# Altium schematic sheet Flatcaster-Link-sch.SchDoc
size A4; SheetNumber: 2; SheetTotal: 2
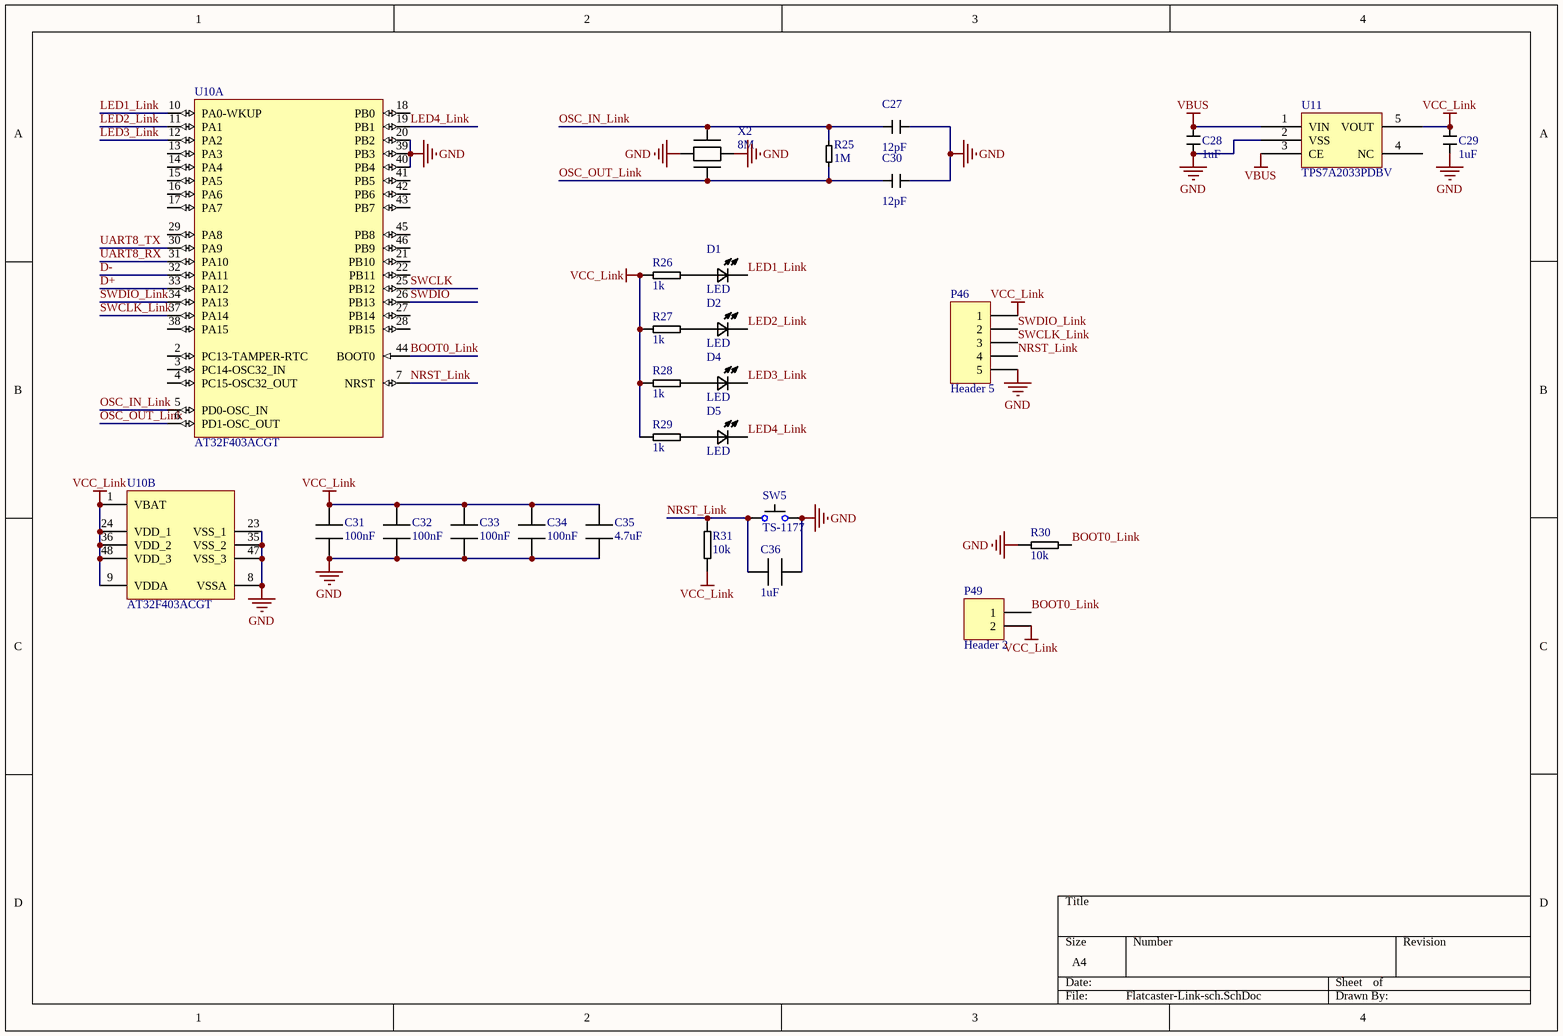
[diagram p0: Flatcaster-Link-sch.SchDoc]

## Parts
C27  12pF  [0603-Cap]
C28  1uF  [0603-Cap]
C29  1uF  [0603-Cap]
C30  12pF  [0603-Cap]
C31  100nF  [0603-Cap]
C32  100nF  [0603-Cap]
C33  100nF  [0603-Cap]
C34  100nF  [0603-Cap]
C35  4.7uF  [0603-Cap]
C36  1uF  [0603-Cap]
D1  LED  [0603-1]
D2  LED  [0603-1]
D4  LED  [0603-1]
D5  LED  [0603-1]
P46  Header 5  [HDR1X5]
P49  Header 2  [HDR1X2]
R25  1M  [0603]
R26  1k  [0603]
R27  1k  [0603]
R28  1k  [0603]
R29  1k  [0603]
R30  10k  [0603]
R31  10k  [0603]
SW5  TS-1177  [BTN3*3]
U10  AT32F403ACGT  [STM-LQFP48_N]  (parts A,B of 2)
U11  TPS7A2033PDBV  [SOT23-5]
X2  8M  [XTAL-3225-4P]

## Nets
GND: C27.1 C28.1 C29.1 C30.1 C31.2 C32.2 C33.2 C34.2 C35.2 C36.1 P46.5 R30.2 SW5.2 U10.8(VSSA) U10.20(PB2) U10.23(VSS_1) U10.35(VSS_2) U10.39(PB3) U10.40(PB4) U10.47(VSS_3) U11.2(VSS) X2.2 X2.4
VBUS: C28.2 U11.1(VIN) U11.3(CE)
VCC_Link: C29.2 C31.1 C32.1 C33.1 C34.1 C35.1 P46.1 P49.2 R26.2 R27.2 R28.2 R29.2 R31.1 U10.1(VBAT) U10.9(VDDA) U10.24(VDD_1) U10.36(VDD_2) U10.48(VDD_3) U11.5(VOUT)
BOOT0_Link: P49.1 R30.1 U10.44(BOOT0)
D+: U10.33(PA12)
D-: U10.32(PA11)
LED1_Link: D1.2 U10.10(PA0-WKUP)
LED2_Link: D2.2 U10.11(PA1)
LED3_Link: D4.2 U10.12(PA2)
LED4_Link: D5.2 U10.19(PB1)
NRST_Link: C36.2 P46.4 R31.2 SW5.1 U10.7(NRST)
OSC_IN_Link: C27.2 R25.2 U10.5(PD0-OSC_IN) X2.3
OSC_OUT_Link: C30.2 R25.1 U10.6(PD1-OSC_OUT) X2.1
SWCLK: U10.25(PB12)
SWCLK_Link: P46.3 U10.37(PA14)
SWDIO: U10.26(PB13)
SWDIO_Link: P46.2 U10.34(PA13)
UART8_RX: U10.31(PA10)
UART8_TX: U10.30(PA9)
NetD1_1: D1.1 R26.1
NetD2_1: D2.1 R27.1
NetD4_1: D4.1 R28.1
NetD5_1: D5.1 R29.1

Not connected (* = marked no-connect by the designer): U10 2(PC13-TAMPER-RTC) 3(PC14-OSC32_IN) 4(PC15-OSC32_OUT) 13(PA3) 14(PA4) 15(PA5) 16(PA6) 17(PA7) 18(PB0) 21(PB10) 22(PB11) 27(PB14) 28(PB15) 29(PA8) 38(PA15) 41(PB5) 42(PB6) 43(PB7) 45(PB8) 46(PB9); U11 4(NC)

## Library data of the parts
C27-C36 = Cap
P46 = Header 5: Header, 5-Pin; LatestRevisionDate: 17-Jul-2002; LatestRevisionNote: Re-released for DXP Platform.; Publisher: Altium Limited
P49 = Header 2: Header, 2-Pin; LatestRevisionDate: 17-Jul-2002; LatestRevisionNote: Re-released for DXP Platform.; Publisher: Altium Limited
R25-R31 = Res
SW5 = Btn: C561512
U10 = STM32F103CBT6: A/D Converter: 2x12-bit (10 Channel); Core: ARM Cortex-M3; FLASH Size (Prog) (kB): 128; I/Os (High Current): 37; Internal RAM Size (kB): 20; Operating Frequency(F) (Processor speed) (MHz): 72; Packing: Tray; Supply Voltage(Vcc) min (V): 2; DatasheetVersion: Rev. 16; PackageVersion: Rev. 6, 06/2013; PackageReference: LQFP48; PackageDescription: 48-Pin Low Profile Quad Flat Package, 7 x 7 mm Body, 0.5 mm Pitch; Supplier 1: Digi-Key; Supplier Part Number 1: 497-6288-ND; Supplier 2: Farnell; Supplier Part Number 2: 1606327; Supplier 3: Newark; Supplier Part Number 3: 11N8296; Supplier 4: Newark; Supplier Part Number 4: 57P1214; Supplier 5: Mouser; Supplier Part Number 5: 511-STM32F103CBT6; Mounting Technology: Surface Mount; PartNumber: STM32F103CBT6; ComponentLink1Description: Manufacturer URL; ComponentLink1URL: http://www.st.com/web/en/home.html; ComponentLink2Description: Datasheet; ComponentLink2URL: http://www.st.com/st-web-ui/static/active/en/resource/technical/document/datasheet/CD00161566.pdf; ComponentLink3Description: Package Specification; ComponentLink3URL: http://www.st.com/st-web-ui/static/active/en/resource/technical/document/datasheet/DM00058181.pdf
U11 = ME6211
X2 = XTAL-4LEAD: C2682774